# EAGLE design fsa1_psu (EAGLE 7.5.0)
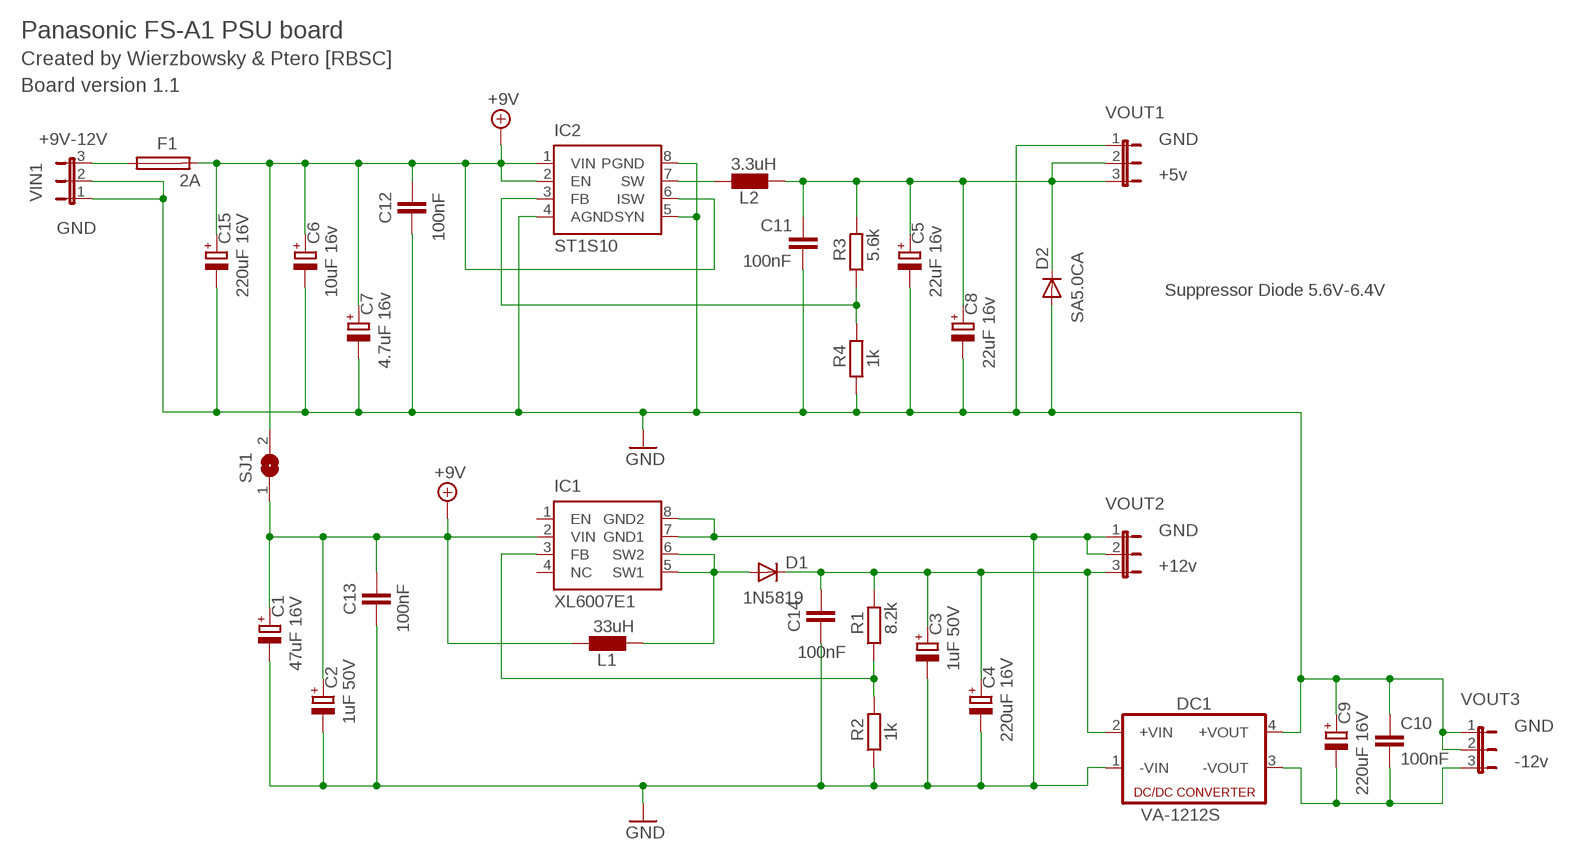
[diagram p0: schematic, sheet 1]

## Parts
C1  47uF 16V  CPOL-EUSANYO_C6  [SANYO-OSCON_C6]
C2  1uF 50V  CPOL-EUSANYO_C6  [SANYO-OSCON_C6]
C3  1uF 50V  CPOL-EUSANYO_C6  [SANYO-OSCON_C6]
C4  220uF 16V  CPOL-EUSANYO_E7  [SANYO-OSCON_E7]
C5  22uF 16v  CPOL-EUSANYO_C6  [SANYO-OSCON_C6]
C6  10uF 16v  CPOL-EUSANYO_C6  [SANYO-OSCON_C6]
C7  4.7uF 16v  CPOL-EUSANYO_C6  [SANYO-OSCON_C6]
C8  22uF 16v  CPOL-EUSANYO_C6  [SANYO-OSCON_C6]
C9  220uF 16V  CPOL-EUSANYO_E7  [SANYO-OSCON_E7]
C10  100nF  C-EUC0805  [C0805]
C11  100nF  C-EUC0805  [C0805]
C12  100nF  C-EUC0805  [C0805]
C13  100nF  C-EUC0805  [C0805]
C14  100nF  C-EUC0805  [C0805]
C15  220uF 16V  CPOL-EUSANYO_E7  [SANYO-OSCON_E7]
D1  1N5819  DIODE-DO204-10  [DO204-10]
D2  SA5.0CA  DIODE-DO204-10  [DO204-10]
DC1  VA-1212S  [4SIL]
F1  2A  PICOFUSE  [PICOFUSE]
IC1  XL6007E1  XL6007E1-SOIC  [SOIC08]
IC2  ST1S10  ST1S10-SOIC  [SOIC08]
L1  33uH  L0204/7  [0204/7]
L2  3.3uH  L0204/7  [0204/7]
R1  8.2k  R-EU_0204/7  [0204/7]
R2  1k  R-EU_0204/7  [0204/7]
R3  5.6k  R-EU_0204/7  [0204/7]
R4  1k  R-EU_0204/7  [0204/7]
SJ1  SJ  [SJ]
VIN1  JP2E_SP  [JP2]
VOUT1  JP2E_SP  [JP2]
VOUT2  JP2E_SP  [JP2]
VOUT3  JP2E_SP  [JP2]

## Nets
5VOUT: C5.+ C8.+ C11.1 D2.C L2.2 R3.2 VOUT1.2 VOUT1.3
+9V: C1.+ C2.+ C6.+ C7.+ C12.1 C13.1 C15.+ F1.2 IC1.2(VIN) IC2.1(VIN) IC2.2(EN) IC2.6(ISW) L1.1 SJ1.1 SJ1.2
+12VOUT: C3.+ C4.+ C14.1 D1.C DC1.2(+VIN) R1.2 VOUT2.3
EXTHOLE3: D1.A IC1.5(SW1) IC1.6(SW2) L1.2
GND: C1.- C2.- C3.- C4.- C5.- C6.- C7.- C8.- C9.+ C10.1 C11.2 C12.2 C13.2 C14.2 C15.- D2.A DC1.1(-VIN) DC1.4(+VOUT) IC1.7(GND1) IC1.8(GND2) IC2.4(AGND) IC2.5(SYN) IC2.8(PGND) R2.1 R4.1 VIN1.1 VIN1.2 VOUT1.1 VOUT2.1 VOUT2.2 VOUT3.1 VOUT3.2
N$1: IC2.7(SW) L2.1
N$2: F1.1 VIN1.3
N$3: IC1.3(FB) R1.1 R2.2
N$30: IC2.3(FB) R3.1 R4.2
N$87: C9.- C10.2 DC1.3(-VOUT) VOUT3.3
Unconnected: IC1.1(EN) IC1.4(NC)

## Notes on the sheet
- Panasonic FS-A1 PSU board
- Created by Wierzbowsky & Ptero [RBSC]
- Board version 1.1
- +9V-12V | GND
- +5v
- GND
- Suppressor Diode 5.6V-6.4V
- GND
- +12v
- GND
- -12v

## Library data of the parts
C1-C9 C15 = rcl:CPOL-EU: POLARIZED CAPACITOR, European symbol
C10-C14 = rcl:C-EU: CAPACITOR, European symbol
D1 D2 = diode:DIODE-: DIODE
DC1 = dc-dc-converter:VA-*?: DC DC Converter Single Output, 1 Watt Motien Technology Co.,Ltd. Source: Data sheet <http://www.motien.com.tw/data_sheet/VA-1%28H%29.pdf>; OC_FARNELL: unknown; OC_NEWARK: unknown
F1 = fuse:PICOFUSE: PICOFUSE 19275, Wickmann; OC_FARNELL: unknown; OC_NEWARK: unknown
IC1 = XL6007E1:XL6007E1: XL6007E1 voltage regulator; OC_FARNELL: unknown; OC_NEWARK: unknown
IC2 = ST1S10:ST1S10: ST1S10 voltage regulator; OC_FARNELL: unknown; OC_NEWARK: unknown
L1 L2 = eagle-ltspice:L: INDUCTOR, European symbol; SPICEMODEL: NONE; SPICEPREFIX: L
R1-R4 = resistor:R-EU_: RESISTOR, European symbol
SJ1 = jumper:SJ: SMD solder JUMPER
VIN1 VOUT1-VOUT3 = jumper_sp:JP2E_SP: JUMPER

## Board
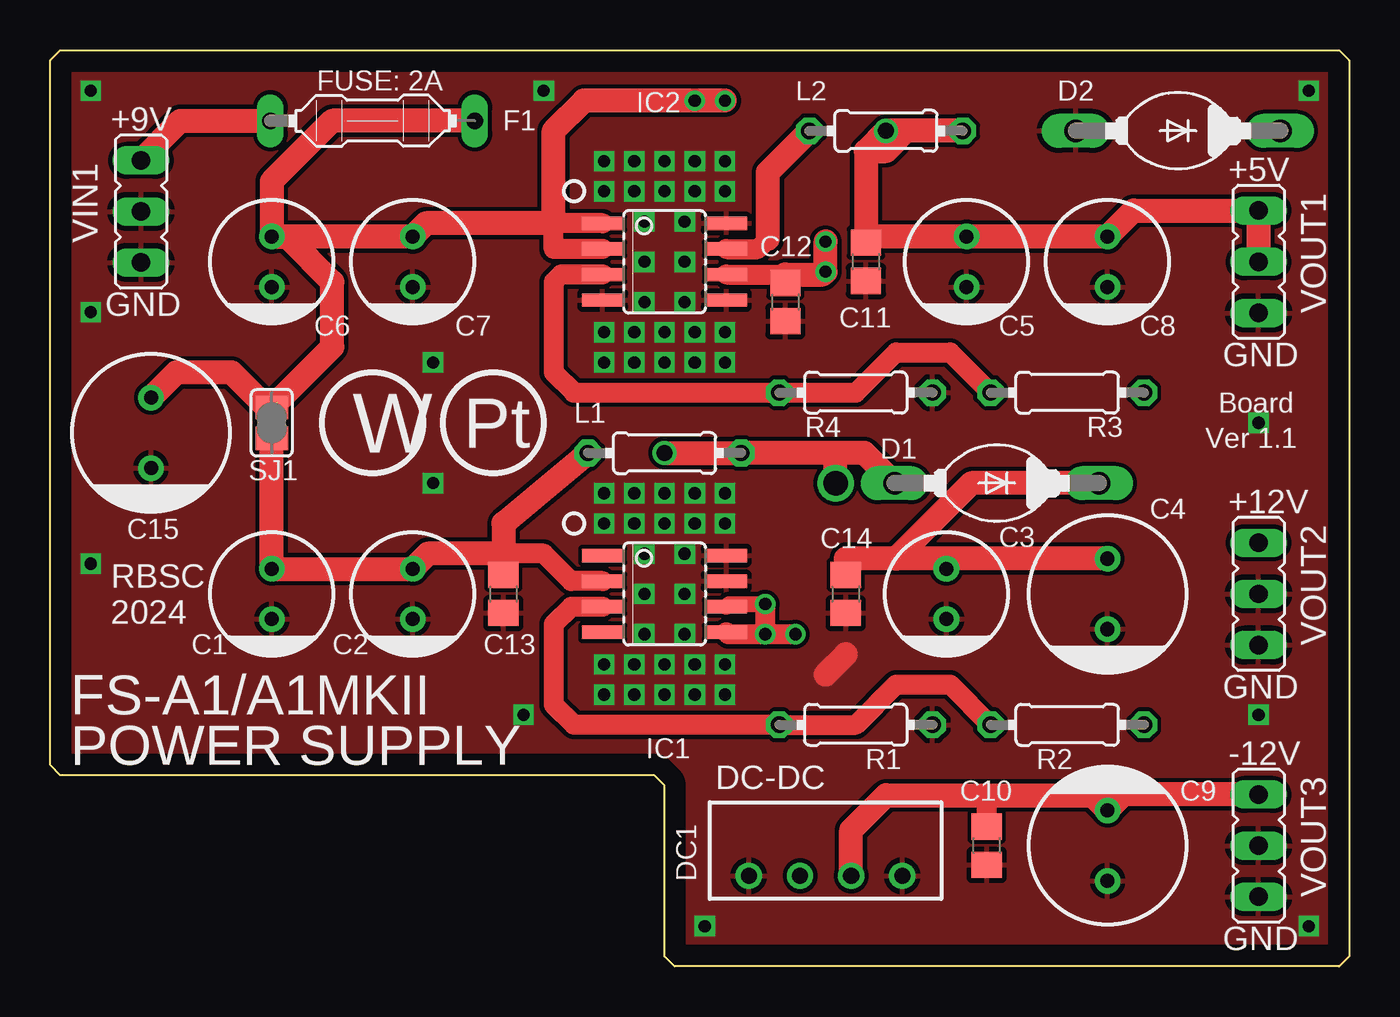
[diagram p1: board, top side]
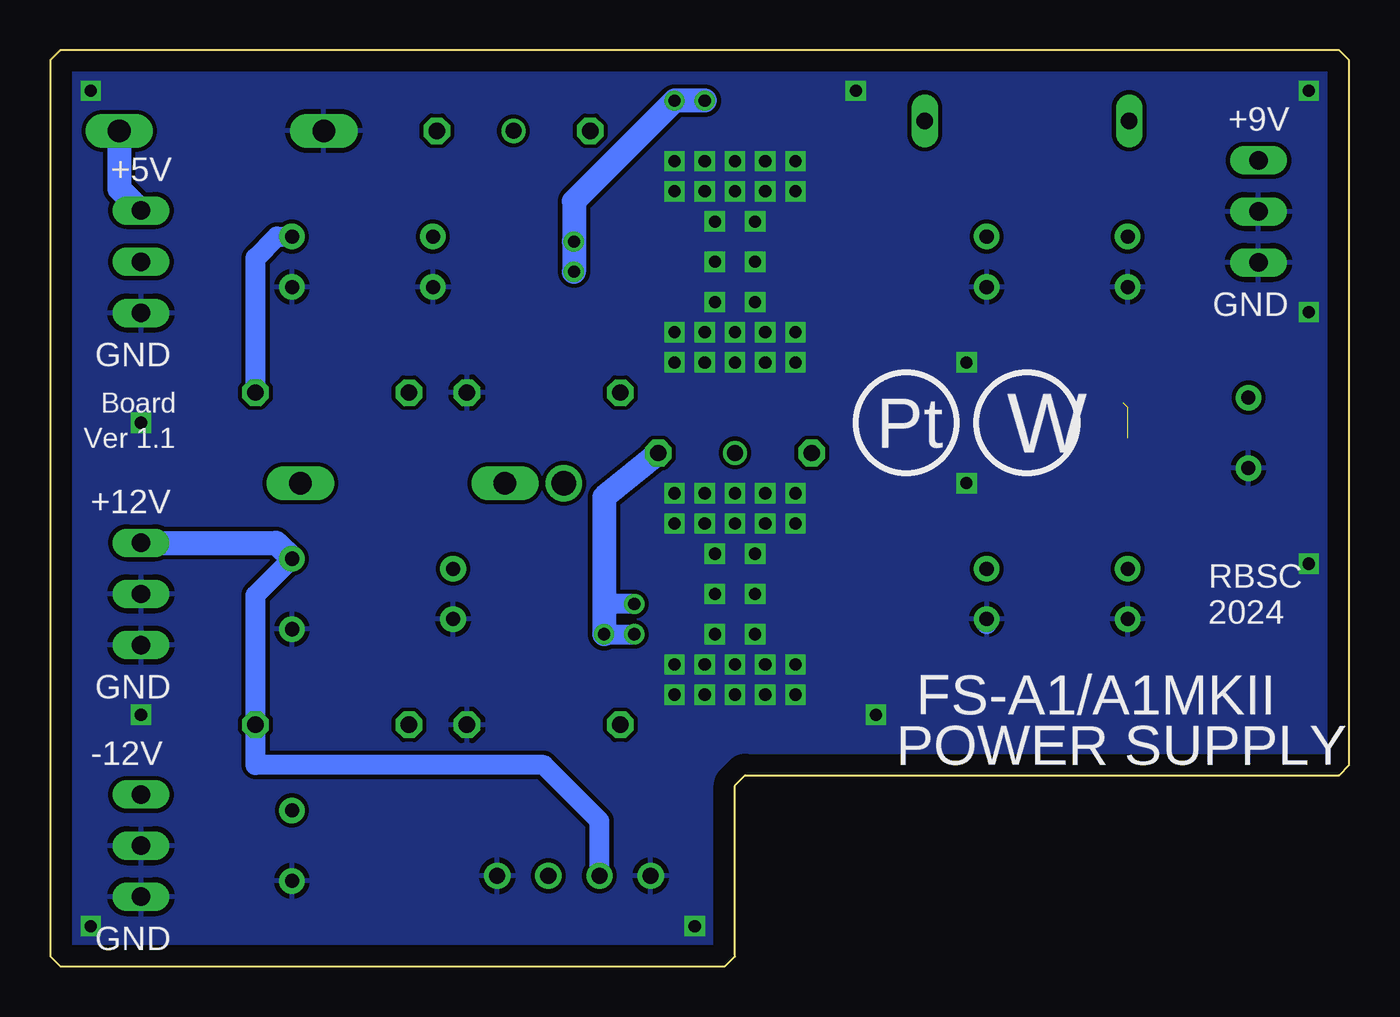
[diagram p2: board, bottom side, seen from below]

Size 64.5 x 45.5 mm. Coordinates in mm from the lower left corner, seen from the top.
Outline: 0.5,45.5 64,45.5 64.5,45 64.5,0.5 64,0 31,0 30.5,0.5 30.5,9 30,9.5 0.5,9.5 0,10 0,45 0.5,45.5
Copper layers (1*16): Top 0.035mm / dielectric 1.5mm / Bottom 0.035mm
Design rules "default *": minimum track width 10mil, minimum drill 24mil, track to track 8mil, track to pad 8mil, pad to pad 8mil, via to via 8mil, smd to smd 8mil, copper to edge 40mil, drill to drill 8mil, minimum pad ring 10mil, minimum via ring 8mil, stop-mask expansion 4mil, vias tented up to drill 25mil, thermal gap 10mil

### Footprints (pad centres in the part's own frame; a part is rotated, then mirrored left to right if it is on the bottom)
SANYO-OSCON_C6 = drill 0.7 pad 1.27: + 1.25,0; - -1.25,0
SANYO-OSCON_E7 = drill 0.7 pad 1.27: + 1.75,0; - -1.75,0
C0805 = smd 1.3 x 1.5: 1 -0.95,0; 2 0.95,0
DO204-10 = drill 1.118 long: A 5.08,0; C -5.08,0
4SIL = drill 0.8: 1 -3.81,0; 2 -1.27,0; 3 1.27,0; 4 3.81,0
PICOFUSE = drill 0.813 long: 1 -5.08,0; 2 5.08,0
SOIC08 = smd 0.66 x 2.032: 1 -1.905,-3.073; 2 -0.635,-3.073; 3 0.635,-3.073; 4 1.905,-3.073; 5 1.905,3.073; 6 0.635,3.073; 7 -0.635,3.073; 8 -1.905,3.073
0204/7 = drill 0.813 octagon: 1 -3.81,0; 2 3.81,0
SJ = smd 1.168 x 1.6: 1 -0.762,0; 2 0.762,0
JP2 = drill 0.914 long: 1 -2.54,0; 2 0,0; 3 2.54,0

### Placement (x,y rotation side)
C1  11,18.5 90 top
C2  18,18.5 90 top
C3  44.5,18.5 90 top
C4  52.5,18.5 90 top
C5  45.5,35 90 top
C6  11,35 90 top
C7  18,35 90 top
C8  52.5,35 90 top
C9  52.5,6 270 top
C10  46.5,6 90 top
C11  40.5,35 270 top
C12  36.5,33 270 top
C13  22.5,18.5 270 top
C14  39.5,18.5 270 top
C15  5,26.5 90 top
D1  47,24 180 top
D2  56,41.5 180 top
DC1  38.5,4.5 0 top
F1  16,42 0 top
IC1  30.5,18.5 270 top
IC2  30.5,35 270 top
L1  30.5,25.5 0 top
L2  41.5,41.5 0 top
R1  50.5,12 0 top
R2  40,12 180 top
R3  50.5,28.5 0 top
R4  40,28.5 180 top
SJ1  11,27 90 top
VIN1  4.5,37.5 90 top
VOUT1  60,35 90 top
VOUT2  60,18.5 90 top
VOUT3  60,6 90 top

### Tracks (layer width: path | path; a pad name or v marks a point on that pad's centre or on a via)
5VOUT
  Top 1.2: VOUT1.2 VOUT1.3 53.79,37.54 C8.+ C5.+ 40.8,36.25 C11.1 40.5,40.5 | L2.2 42.5,41.5 | 42.5,41.5 41.5,41.5 40.5,40.5 | 40.5,40.5 41.5,40.5 42.5,41.5
  Bottom 1: R3.2 54.31,35.19 53.25,36.25 C8.+
  Bottom 1.2: D2.C 61.08,38.62 VOUT1.3
+9V  (via drill 0.6)  (2 unrouted)
  Top 1: IC2.1 25,36.91 25,35.63 IC2.2 | IC1.2 25.86,19.14 24.5,20.5 22.5,20.5 C13.1 | IC2.6 36.5,34.37
  Top 1.2: C6.+ C7.+ 18.66,36.91 25,36.91 25,41.5 26.5,43 v32,43 v33.5,43 | L1.1 25.5,24.5 22.5,22 22.5,20.5 18.75,20.5 C2.+ C1.+ SJ1.1 | v38.5,36 v38.5,34.5 38.37,34.37 36.5,34.37 C12.1 | C6.+ 11.75,36.25 14,34 14,30.76 11.24,28 10.5,28 9,29.5 6.25,29.5 C15.+ | F1.2 14,42 11,39 C6.+
  Bottom 1.2: v32,43 v33.5,43 38.5,38 v38.5,36 v38.5,34.5
+12VOUT
  Top 1.2: C4.+ 44.5,20.25 | 44.5,20.25 C3.+ | 44.5,20.25 42,20.25 | 42,20.25 39.8,20.25 39.5,20.25 39.68,19.93 C14.1 39.5,20 | D1.C 45.75,24 42,20.25
  Bottom 1: DC1.2 37.23,7.23 40,10 54.31,10 R1.2 54.31,18.44 C4.+
  Bottom 1.2: VOUT2.3 53.29,21.04 C4.+
EXTHOLE1  (via drill 0.8 pad 0.41)
  other vias: 41.5,41.5
EXTHOLE3  (via drill 0.6, 0.8 pad 0.41, 1.2 pad 0.41)
  Top 0.8: IC1.6 33.71,18 v35.5,18
  Top 1: v37,16.5 v35.5,16.5 | v35.5,16.5 33.67,16.5 IC1.5 | v35.5,18 v35.5,16.5
  Top 1.2: 39,25.5 40.42,25.5 D1.A | 39,25.5 L1.2 v30.5,25.5 | v39,24 39,25.5
  Bottom 1: v37,16.5 v35.5,16.5 | v35.5,18 37,18
  Bottom 1.2: L1.2 37,23.31 37,18 v37,16.5
GND  (via drill 0.6)
  Top 1.2: 39.5,15.5 38.5,14.5
  Bottom 1: C2.- 18,17
  other vias: 27.5,38.5 29,38.5 30.5,38.5 32,38.5 32,40 30.5,40 29,40 27.5,40 27.5,23.5 29,23.5 30.5,23.5 32,23.5 32,22 30.5,22 29,22 27.5,22 27.5,15 29,15 30.5,15 32,15 32,13.5 30.5,13.5 29,13.5 27.5,13.5 30.5,31.5 29,31.5 32,31.5 32,30 30.5,30 29,30 2,43.5 62.5,43.5 23.5,12.5 62.5,2 31.5,37 29.5,37 29.5,35 31.5,35 29.5,33 31.5,33 29.5,20.5 31.5,20.5 29.5,18.5 31.5,18.5 29.5,16.5 31.5,16.5 32.5,2 60,27 60,12.5 2,32.5 2,20 24.5,43.5 19,24 19,30 27.5,31.5 27.5,30 33.5,31.5 33.5,30 33.5,38.5 33.5,22 33.5,15 33.5,13.5 33.5,40 33.5,23.5
  pour Top: 0,45.5 64.5,45.5 64.5,0 30.5,0 30.5,9.5 0,9.5
  pour Bottom: 0,45.5 64.5,45.5 64.5,0 30.5,0 30.5,9.5 0,9.5
N$1
  Top 1: IC2.7 35.13,35.63 35.63,36.13
  Top 1.2: 35.63,36.13 35.63,39.45 L2.1
N$2
  Top 1.2: F1.1 6.46,42 VIN1.3
N$3
  Top 1: R1.1 44.69,14 42,14 40,12 R2.2 26,12 25,13 25,17 25.86,17.86 IC1.3
N$30
  Top 1: R3.1 44.69,30.5 42,30.5 40,28.5 R4.2 26,28.5 25,29.5 25,34 25.36,34.37 IC2.3
N$87
  Top 1: C10.2 46.5,8.5
  Top 1.2: VOUT3.3 53.29,8.54 C9.- 51.75,8.5 46.5,8.5 41.5,8.5 39.77,6.77 DC1.3

### Text on the board
tNames: FUSE: 2A | +9V | +5V | GND | GND | Board | Pt | Ver 1.1 | W | +12V | RBSC / 2024 | GND | FS-A1/A1MKII | POWER SUPPLY | DC-DC | -12V | GND
bNames: +9V | +5V | GND | GND | Board | Pt | Ver 1.1 | W | +12V | RBSC / 2024 | GND | FS-A1/A1MKII | POWER SUPPLY | -12V | GND